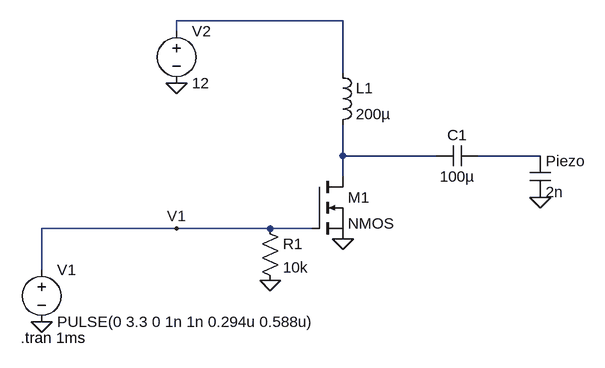
[diagram p0: schematic V1_based_on_demo_model.asc]
V1_based_on_demo_model.asc, the LTspice schematic file:
Version 4.1
SHEET 1 880 680
WIRE 480 -256 224 -256
WIRE 224 -240 224 -256
WIRE 480 -176 480 -256
WIRE 480 -48 480 -96
WIRE 624 -48 480 -48
WIRE 784 -48 688 -48
WIRE 480 -16 480 -48
WIRE 224 64 16 64
WIRE 368 64 224 64
WIRE 432 64 368 64
WIRE 16 128 16 64
FLAG 16 208 0
FLAG 480 80 0
FLAG 224 -160 0
FLAG 224 64 V1
FLAG 368 144 0
FLAG 784 16 0
SYMBOL voltage 16 112 R0
WINDOW 123 0 0 Left 0
WINDOW 39 0 0 Left 0
SYMATTR InstName V1
SYMATTR Value PULSE(0 3.3 0 1n 1n 0.294u 0.588u)
SYMBOL nmos 432 -16 R0
SYMATTR InstName M1
SYMBOL voltage 224 -256 R0
WINDOW 123 0 0 Left 0
WINDOW 39 0 0 Left 0
SYMATTR InstName V2
SYMATTR Value 12
SYMBOL ind 464 -192 R0
SYMATTR InstName L1
SYMATTR Value 200µ
SYMBOL cap 688 -64 R90
WINDOW 0 0 32 VBottom 2
WINDOW 3 32 32 VTop 2
SYMATTR InstName C1
SYMATTR Value 100µ
SYMBOL res 352 48 R0
SYMATTR InstName R1
SYMATTR Value 10k
SYMBOL cap 768 -48 R0
SYMATTR InstName Piezo
SYMATTR Value 2n
TEXT -16 232 Left 2 !.tran 1ms

The netlist it stands for:
* V1_based_on_demo_model.asc
V1 V1 0 PULSE(0 3.3 0 1n 1n 0.294u 0.588u)
M1 N002 V1 0 0 NMOS
V2 N001 0 12
L1 N001 N002 200µ
C1 N003 N002 100µ
R1 V1 0 10k
C§Piezo N003 0 2n
.model NMOS NMOS
.model PMOS PMOS
.lib standard.mos
.tran 1ms
.backanno
.end